# Altium schematic sheet Barrido de doble fuente DC.SchDoc
size A4
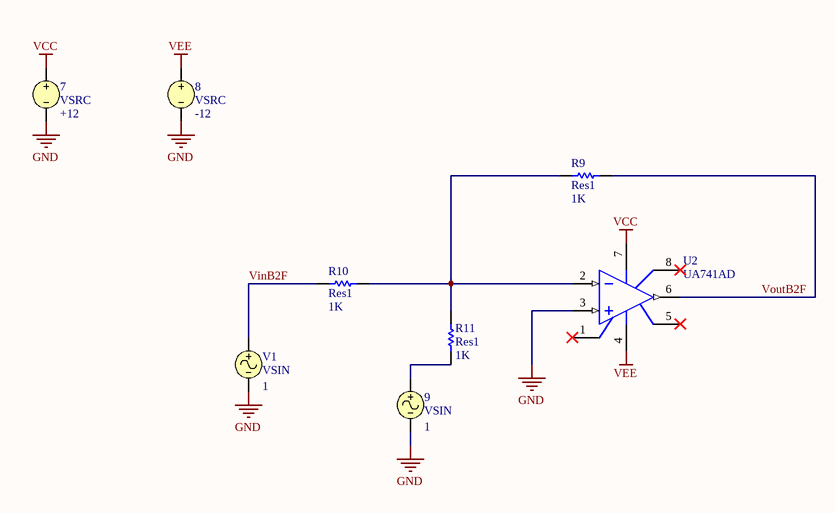
[diagram p0: Barrido de doble fuente DC.SchDoc]

## Parts
7  VSRC  value +12
8  VSRC  value -12
9  VSIN  Amplitude: 1
R9  Res1  value 1K  [AXIAL-0.3]
R10  Res1  value 1K  [AXIAL-0.3]
R11  Res1  value 1K  [AXIAL-0.3]
U2  UA741AD  [SO8_L]
V1  VSIN  Amplitude: 1

## Nets
GND: 7.2 8.2 9.2 U2.3(IN+) V1.2
VCC: 7.1 U2.7(V+)
VEE: 8.1 U2.4(V-)
VinB2F: R10.1 V1.1
VoutB2F: R9.2 U2.6(OUT)
Net9_1: 9.1 R11.1
NetR9_1: R9.1 R10.2 R11.2 U2.2(IN-)

Not connected (* = marked no-connect by the designer): U2 1(OS_NULL)* 5(OS_NULL)* 8(NC)*

## Library data of the parts
7 8 = VSRC: Voltage Source; Note: PCB Footprint - Not required; Published: 8-Jun-2000; LatestRevisionDate: 17-Jul-2002; LatestRevisionNote: Re-released for DXP Platform.; PackageReference: Not Applicable; Publisher: Altium Limited
9 V1 = VSIN: Sinusoidal Voltage Source; Note: PCB Footprint - Not required; Published: 8-Jun-2000; LatestRevisionDate: 15-Nov-2004; LatestRevisionNote: Corrected Netlist.; PackageReference: Not Applicable; Publisher: Altium Limited
R9-R11 = Res1: Resistor; Published: 8-Jun-2000; LatestRevisionDate: 17-Jul-2002; LatestRevisionNote: Re-released for DXP Platform.; PackageReference: AXIAL-0.3; Publisher: Altium Limited; PackageDescription: Axial Device, Thru-Hole; 2 Leads; 0.3 in Pin Spacing
U2 = UA741AD: General-Purpose Single Operational Amplifier; Published: 24-Aug-2001; LatestRevisionDate: 13-Apr-2006; LatestRevisionNote: IPC-7351 Footprint Added.; DatasheetVersion: Oct-1997; PackageVersion: Dec-2002; PackageReference: SO8; Publisher: Altium Limited; PackageDescription: 8-Pin Small Outline Integrated Circuit 1.27 mm Pitch; Code_JEDEC: MS-012-AA; Code_IPC: SOIC127P600-8; ComponentLink1Description: Manufacturer Link; ComponentLink1URL: http://www.st.com/; ComponentLink2Description: Datasheet; ComponentLink2URL: http://www.st.com/stonline/products/literature/ds/5304/ua741.pdf